# Altium schematic sheet serial.SchDoc
size A4; Organization: Altium Limited; Address1: L3, 12a Rodborough Rd; Address2: Frenchs Forest; Address3: NSW; Address4: Australia 2086; DocumentNumber: 7; SheetNumber: 7; SheetTotal: 7
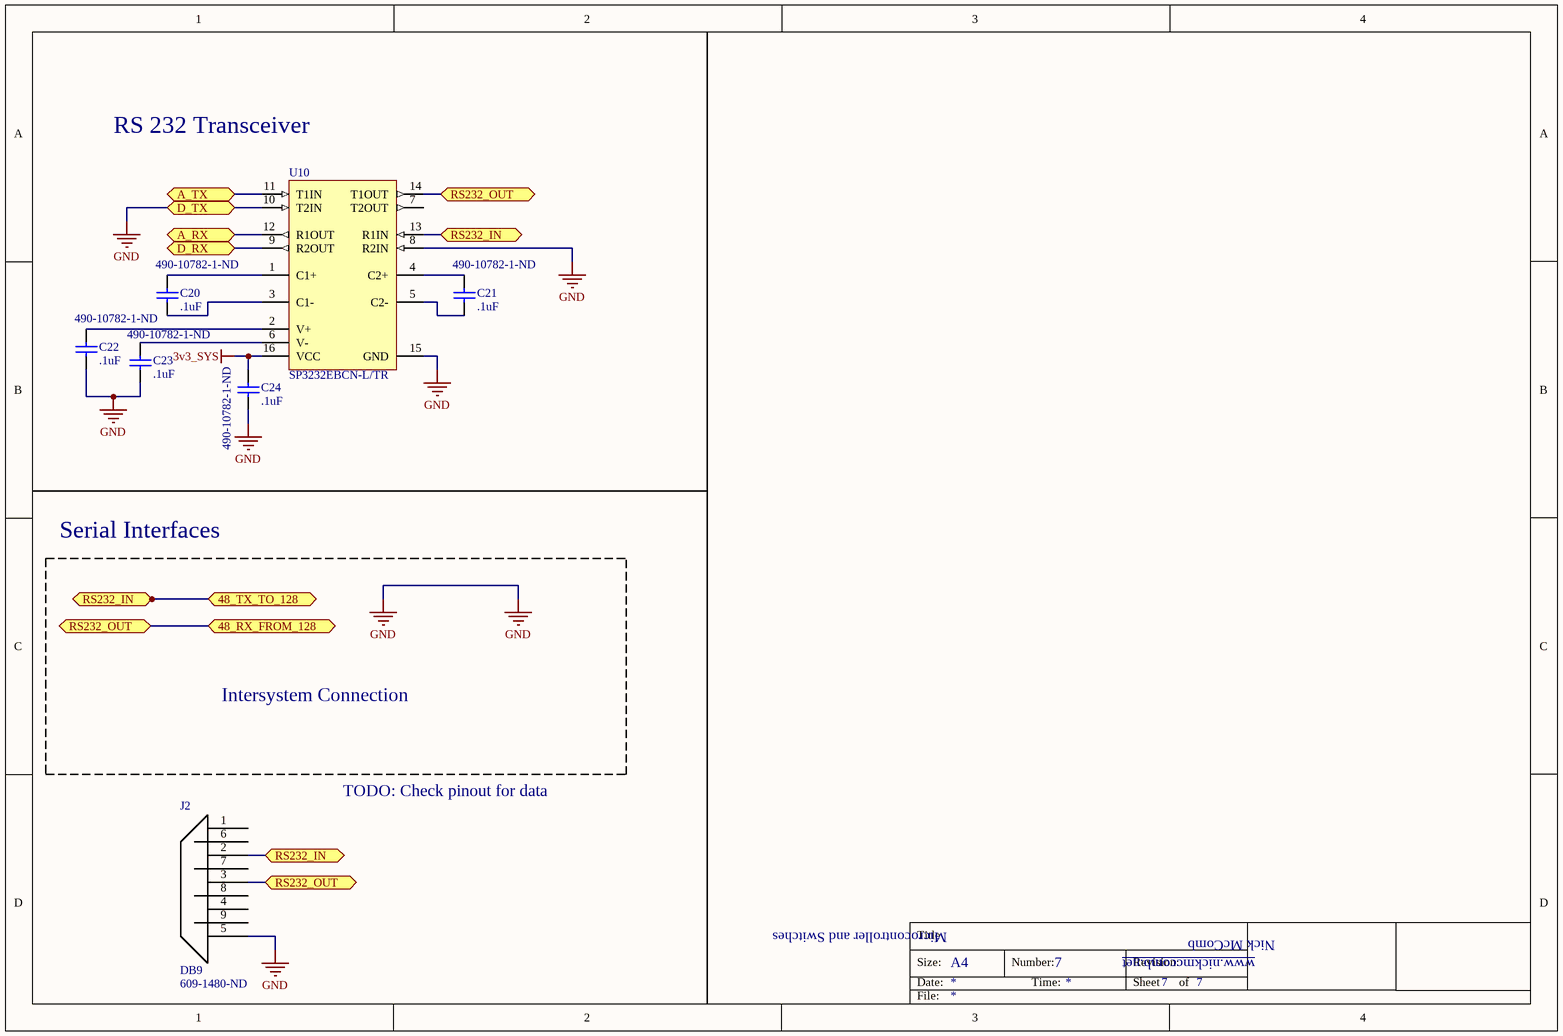
[diagram p0: serial.SchDoc]

## Parts
C20  value .1uF  Supplier Part Number 1: 490-10782-1-ND  [C0805]  (hidden comment: 0805 style, by default)
C21  value .1uF  Supplier Part Number 1: 490-10782-1-ND  [C0805]  (hidden comment: 0805 style, by default)
C22  value .1uF  Supplier Part Number 1: 490-10782-1-ND  [C0805]  (hidden comment: 0805 style, by default)
C23  value .1uF  Supplier Part Number 1: 490-10782-1-ND  [C0805]  (hidden comment: 0805 style, by default)
C24  value .1uF  Supplier Part Number 1: 490-10782-1-ND  [C0805]  (hidden comment: 0805 style, by default)
J2  DB9  Supplier Part Number 1: 609-1480-ND  [DSUB CONNECTOR]
U10  SP3232EBCN-L/TR  [EXAR-NSOIC-16_N]

## Ports
48_RX_FROM_128, 48_TX_TO_128, A_RX, A_TX, D_RX, D_TX, RS232_IN, RS232_OUT

## Nets
3v3_SYS: C24.2 U10.16(VCC)
GND: C22.1 C23.1 C24.1 J2.5 U10.8(R2IN) U10.10(T2IN) U10.15(GND) ; port D_TX
48_RX_FROM_128: J2.3 U10.14(T1OUT) ; port RS232_OUT, port 48_RX_FROM_128
48_TX_TO_128: J2.2 U10.13(R1IN) ; port RS232_IN, port 48_TX_TO_128
A_RX: U10.12(R1OUT) ; port A_RX
A_TX: U10.11(T1IN) ; port A_TX
D_RX: U10.9(R2OUT) ; port D_RX
NetC20_1: C20.1 U10.3(C1-)
NetC20_2: C20.2 U10.1(C1+)
NetC21_1: C21.1 U10.5(C2-)
NetC21_2: C21.2 U10.4(C2+)
NetC22_2: C22.2 U10.2(V+)
NetC23_2: C23.2 U10.6(V-)

Not connected (* = marked no-connect by the designer): J2 1 4 6 7 8 9; U10 7(T2OUT)

## Notes on the sheet
- RS 232 Transceiver
- Serial Interfaces
- Intersystem Connection
- TODO: Check pinout for data
- Microcontroller and Switches
- Title
- Size:
- Date:
- A4
- Number:
- Time:
- Revision:
- Sheet
- of
- www.nickmccomb.net
- Nick McComb
- File:

## Library data of the parts
C20-C24 = Cap: Capacitor; Manufacturer: Murata Electronics North America; Manufacturer Part Number: GRM21BR71H104JA01L; Capacitance: 0.10µF; Tolerance: ±5%; Voltage - Rated: 50V; Temperature Coefficient: X7R; Published: 8-Jun-2000; LatestRevisionDate: 17-Jul-2002; LatestRevisionNote: Re-released for DXP Platform.; PackageReference: RAD-0.3; Publisher: Altium Limited; PackageDescription: Radial Cap, Thru-Hole; 2 Leads; 0.3 in Pin Spacing; Supplier 1: Digi-Key; RoHS: RoHS Compliant; Category: Capacitors; Stock 1: 17503; Pricing 1: 1=0.16, 10=0.113, 50=0.065, 100=0.0537, 250=0.0452, 500=0.03786, 1000=0.03108 (USD); Packaging: Cut Tape (CT); Mounting Type: Surface Mount, MLCC; Operating Temperature: -55°C ~ 125°C; Applications: General Purpose; Ratings: -; Package / Case: 0805 (2012 Metric); Size / Dimension: 0.079" L x 0.049" W (2.00mm x 1.25mm); Height - Seated (Max): -; Thickness (Max): 0.053" (1.35mm); Lead Spacing: -; Features: -; Lead Style: -; ComponentLink1URL: http://www.murata.com/~/media/webrenewal/support/library/catalog/products/capacitor/mlcc/c02e.pdf; ComponentLink1Description: http://www.murata.com/~/media/webrenewal/support/library/catalog/products/capacitor/mlcc/c02e.pdf
J2 = DB9: Manufacturer: Amphenol / FCI; Manufacturer Part Number: D09P33E4GV00LF; Connector Style: D-Sub; Connector Type: Plug, Male Pins; Number of Positions: 9; Flange Feature: Mating Side, Female Screwlock (4-40); Voltage Rating: 300V; Current Rating: 5A; Supplier 1: Digikey; Stock 1: 5536; Pricing 1: 1=2.3, 10=2.086, 25=1.958, 50=1.8728, 100=1.7877, 250=1.6175, 500=1.4898, 1000=1.277, 2500=1.1918 (USD); Category: Connectors, Interconnects; Family: D-Sub Connectors; Series: Delta D; Packaging: Tray; Number of Rows: 2; Shell Size, Connector Layout: 1 (DE, E); Contact Type: Signal; Mounting Type: Through Hole, Right Angle; Termination: Solder; Features: Board Lock, Grounding Indents; Shell Material, Finish: Steel, Tin Plated; Contact Finish: Gold; Contact Finish Thickness: Flash; Ingress Protection: -; Operating Temperature: -55°C ~ 125°C; Housing Material: Polybutylene Terephthalate (PBT); Color: Black; ComponentLink1URL: https://datasheet.ciiva.com/16915/70236919-16915382.pdf; ComponentLink1Description: https://datasheet.ciiva.com/16915/70236919-16915382.pdf; ComponentLink2URL: https://datasheet.ciiva.com/15177/getdatasheetpartid-123290-15177610.pdf; ComponentLink2Description: https://datasheet.ciiva.com/15177/getdatasheetpartid-123290-15177610.pdf; ComponentLink3URL: https://datasheet.ciiva.com/10376/c01-8646-0151-10376667.pdf; ComponentLink3Description: https://datasheet.ciiva.com/10376/c01-8646-0151-10376667.pdf; ComponentLink4URL: https://datasheet.ciiva.com/652/c01-8646-0151-652476.pdf; ComponentLink4Description: https://datasheet.ciiva.com/652/c01-8646-0151-652476.pdf; ComponentLink5URL: https://datasheet.ciiva.com/16663/c01-8646-0151-16663004.pdf; ComponentLink5Description: https://datasheet.ciiva.com/16663/c01-8646-0151-16663004.pdf
U10 = CMP-0935-00001-1: RS-232 Transceiver with 2-Drivers / 2-Receivers, 3 to 5.5 V, 250 Kbps, 16-Pin NSOIC, 0 to 70 degC, Pb-free, Tape and Reel; Manufacturer: Exar Corporation; No. of Tx: 2; ESD: 15 KV; ComponentLink1URL: http://www.exar.com/; ComponentLink1Description: Manufacturer URL; PackageDescription: 16-Pin Small Outline Integrated Circuit, Body 9.9 x 3.9 mm, Pitch 1.27 mm; Data Rate: 250 Kbps; No. of Rx: 2; DatasheetVersion: Rev. 1.0.2; Packing: Tape and Reel; PartNumber: SP3232EBCN-L/TR; Temp. Range: 0 to 70 degC; VCC: 3 to 5.5 V; ComponentLink2Description: Datasheet; PackageReference: NSOIC-16; Mounting Technology: Surface Mount; ComponentLink2URL: https://www.exar.com/common/content/document.ashx?id=632&languageid=1033